# EasyEDA Pro project busmaster-v102.eprj, schematic bus-board
Board Name: bus-board; Create Date: 2025-11-10; Page Name: P1; Project Name: busmaster-v102; Schematic Name: bus-board; Update Date: 2025-11-12; Company: EasyEDA.com; Page Size: A4; Version: V1.0
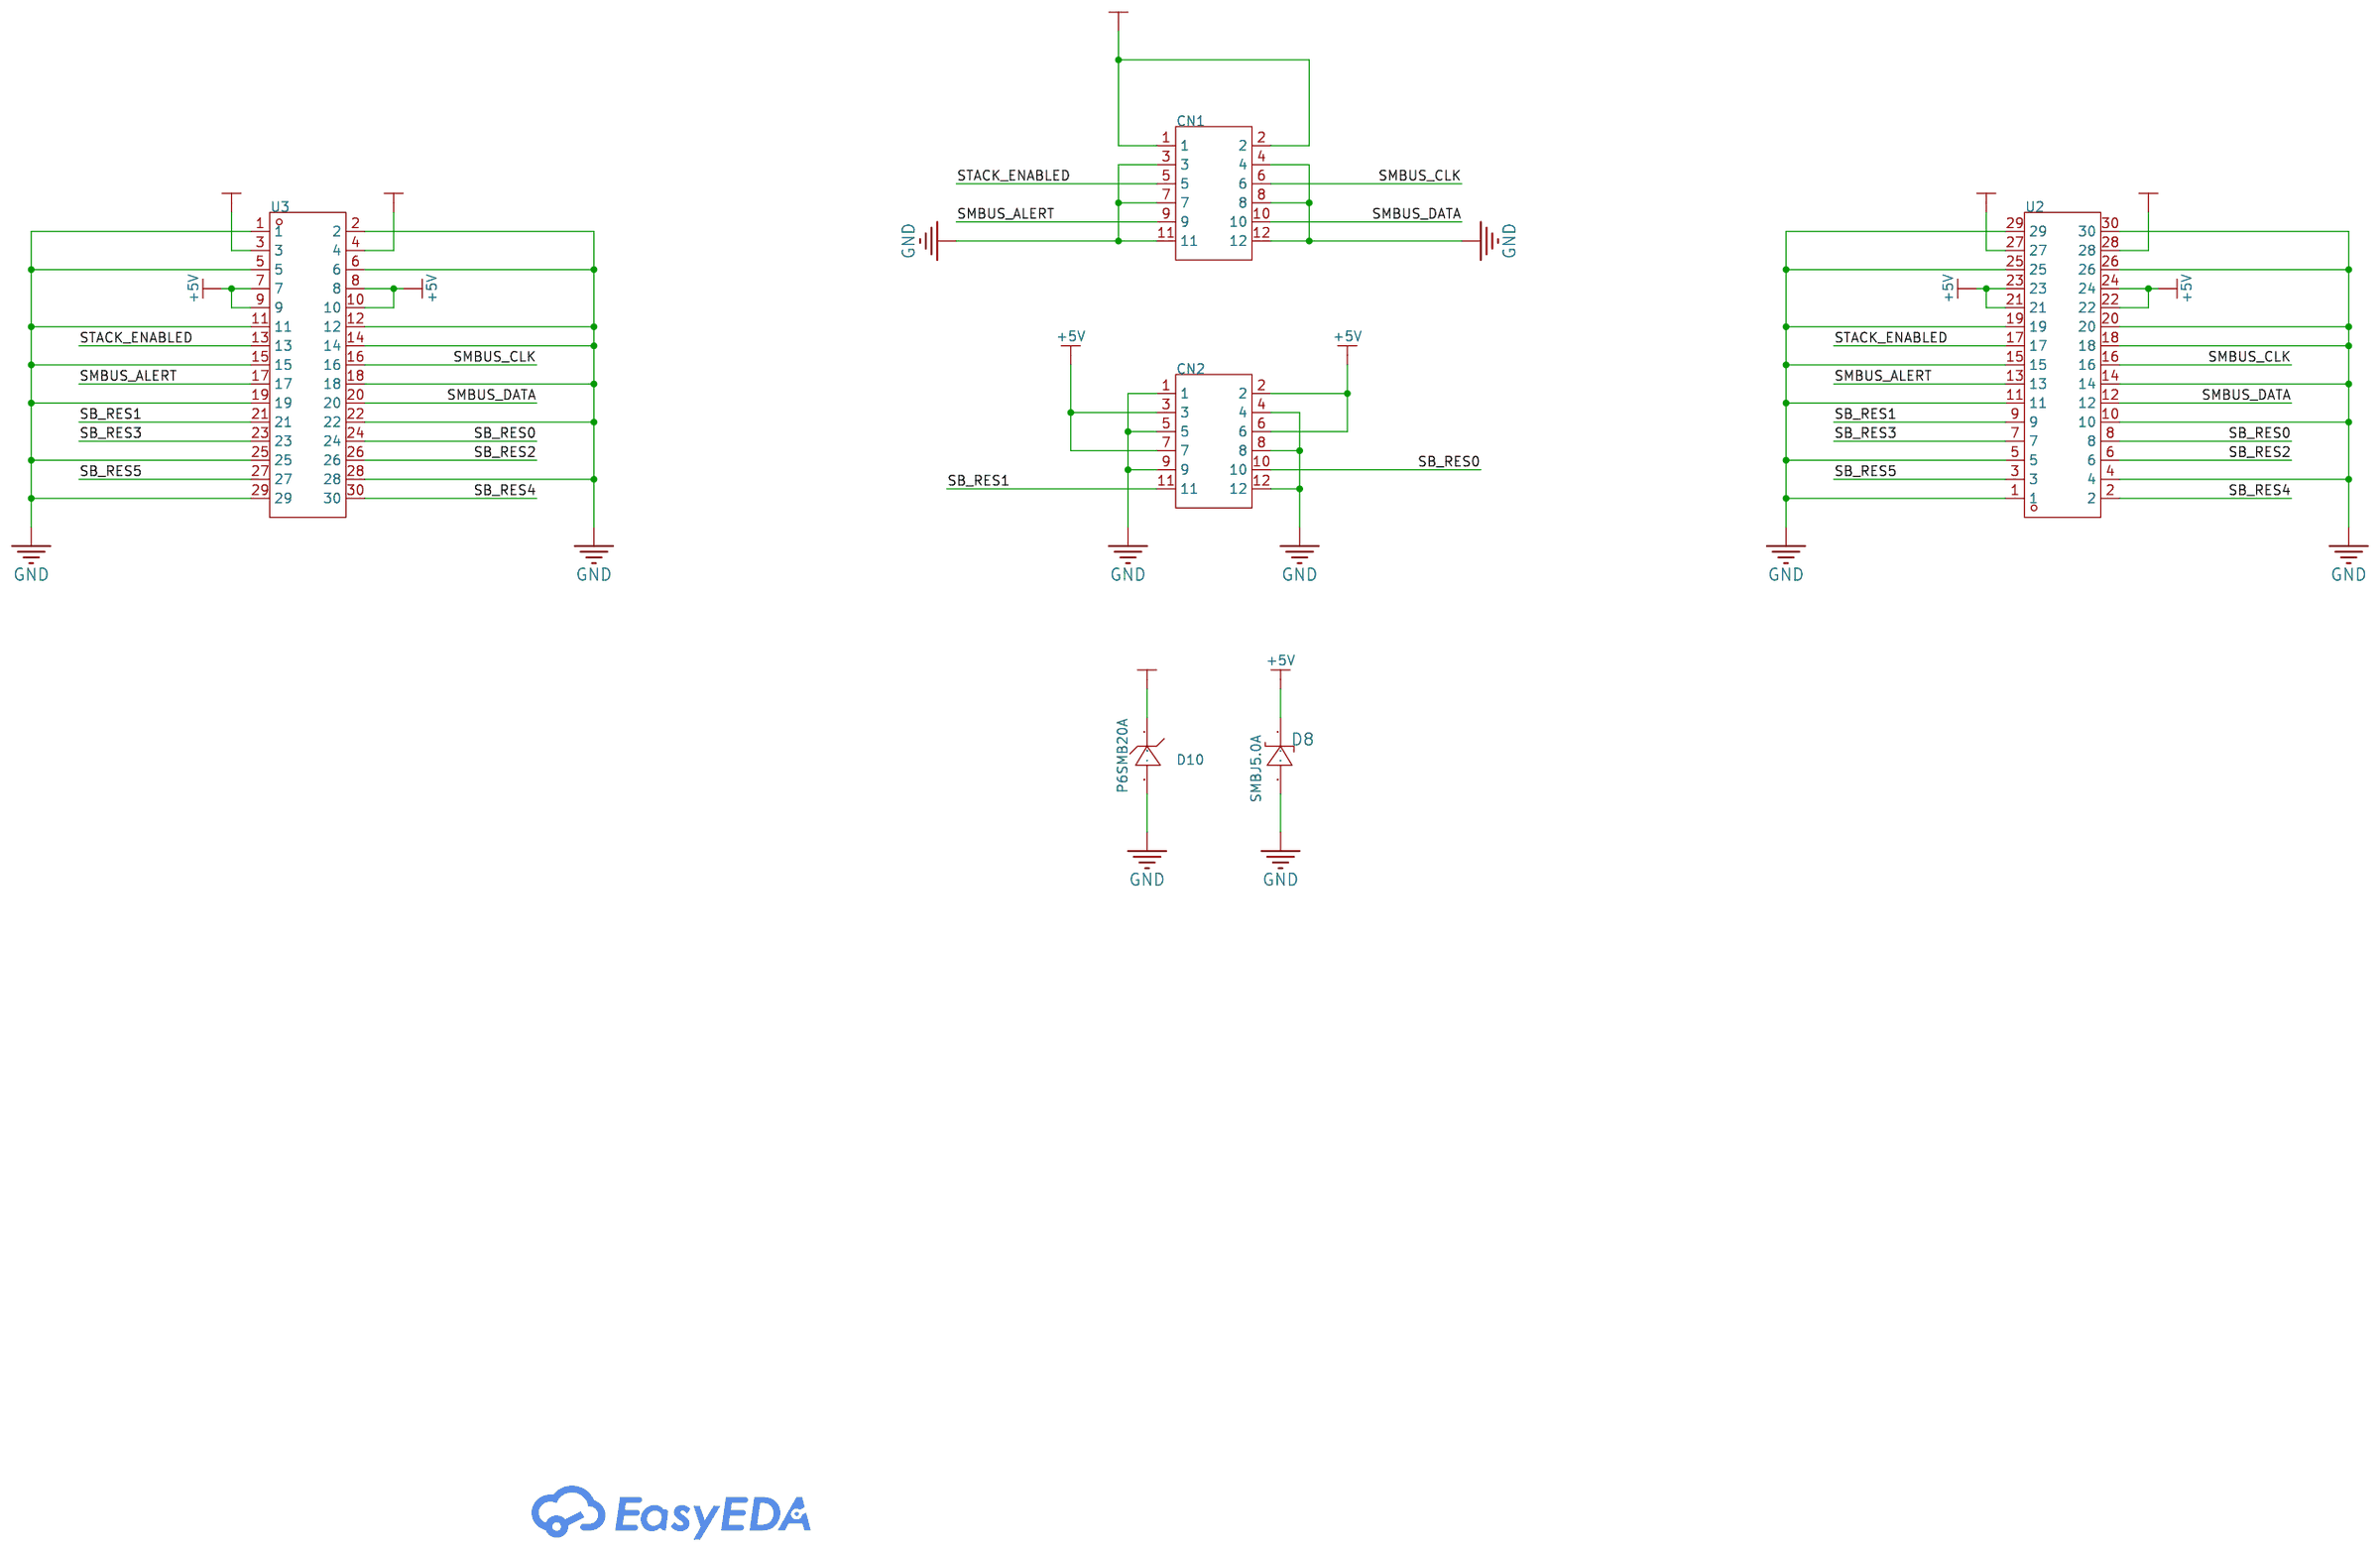
[diagram p0: schematic sheet]

## Parts
CN1  PH2.0-01-06PZS  [HDR-TH_12P-P2.00-V-M-R2-C6-S2.00]
CN2  PH2.0-01-06PZS  [HDR-TH_12P-P2.00-V-M-R2-C6-S2.00]
D8  SMBJ5.0A  [SMB_L4.6-W3.6-LS5.3-RD]
D10  P6SMB20A  [SMB_L4.5-W3.6-LS5.4-RD]
U2  PM254-2-15-W-8.5  [HDR-TH_30P-P2.54-H-F-R2-C15-W8.5]
U3  PM254-2-15-W-8.5  [HDR-TH_30P-P2.54-H-F-R2-C15-W8.5]

## Library data of the parts
CN1 CN2 = PH2.0-01-06PZS: Pin Structure:2x6P Pitch:2mm Row Spacing:2mm Circluar Pins/Square Pins:Pin Header Mounting Type:Through Hole Number of Rows:2 Number of Pins:12P Current Rating:1.5A Length of Mating Pin:3.9mm Insulation Height:2mm Length of End Connection Pin:2.8mm Contac; LCSC Part Name: 2x6P 间距:2mm 方针 直插; Supplier Part: C49286580; Manufacturer: XUNPU(讯普); Supplier Footprint: 插件,P=2mm; JLCPCB Part Class: Extended Part; Datasheet: https://item.szlcsc.com/datasheet/PH2.0-01-06PZS/51736339.html; Supplier: LCSC; Pin Structure: 2x6P; Pitch: 2mm; Row Spacing: 2mm; Circluar Pins/Square Pins: Pin Header; Mounting Type: Through Hole; Number of Rows: 2; Number of Pins: 12P; Current Rating: 1.5A; Length of Mating Pin: 3.9mm; Insulation Height: 2mm; Length of End Connection Pin: 2.8mm; Contact Material: Brass; Contact Plating: Gold; Operating Temperature: -40℃~+105℃; Color: Black
D8 = SMBJ5.0A_C10204: LCSC Part Name: 单向TVS 5V截止 峰值浪涌电流：65.3A@10/1000us; Supplier Part: C10204; Manufacturer: RUILON(瑞隆源); Supplier Footprint: DO-214AA(SMB); JLCPCB Part Class: Extended Part; Datasheet: https://item.szlcsc.com/datasheet/SMBJ5.0A/10744.html; Supplier: LCSC; Polarity: Unidirectional; Reverse Stand-Off Voltage (Vrwm): 5V; Clamping Voltage: 9.2V; Peak Pulse Current (Ipp): 65.3A@10/1000us; Peak Pulse Power Dissipation (Ppp): 600W@10/1000us; Voltage - Breakdown: 7.25V; Reverse Leakage Current (Ir): 800uA; Operating Temperature: -55℃~+150℃; level of protection: IEC 61000-4-4；IEC 61000-4-2; Type: TVS
D10 = P6SMB20A_C2916107: Supplier Part: C2916107; Manufacturer: DOWO(东沃); Supplier Footprint: SMB; JLCPCB Part Class: Extended Part; Datasheet: https://atta.szlcsc.com/upload/public/pdf/source/20211111/69C9124696FB34B8A3D6BD83C2FAA930.pdf; Supplier: LCSC; Reverse Stand-Off Voltage (Vrwm): 17.1V; Maximum Clamping Voltage: 27.7V; Peak Pulse Current (Ipp)@10/1000us: 21.66A; Breakdown Voltage: 19V; Reverse Leakage Current (Ir): 1uA; Type: TVS
U2 U3 = PM254-2-15-W-8.5: LCSC Part Name: 2x15P 间距:2.54mm 弯插; Supplier Part: C2897435; Manufacturer: HCTL(华灿天禄); Supplier Footprint: 弯插,P=2.54mm; JLCPCB Part Class: Extended Part; Datasheet: https://item.szlcsc.com/datasheet/PM254-2-15-W-8.5/3142440.html; Supplier: LCSC; Holes Structure: 2x15P; Pitch: 2.54mm; Row Spacing: 2.54mm; Circular Hole / Square Hole: Square Hole; Mounting Type: Right Angle; Number of Rows: 2; Number of Positions: 30P; Current Rating: 3A; Holes Direction: Side; Insulation Height: 8.5mm; Contact Material: Copper Alloy; Operating Temperature: -40℃~+105℃

## Nets
+5V: CN2.2 CN2.3 CN2.6 CN2.7 D8.1(K) U2.21 U2.22 U2.23 U2.24 U3.7 U3.8 U3.9 U3.10
+12V: CN1.1 CN1.2 D10.1(C) U2.27 U2.28 U3.3 U3.4
GND: CN1.3 CN1.4 CN1.7 CN1.8 CN1.11 CN1.12 CN2.1 CN2.4 CN2.5 CN2.8 CN2.9 CN2.12 D8.2(A) D10.2(A) U2.1 U2.4 U2.5 U2.10 U2.11 U2.14 U2.15 U2.18 U2.19 U2.20 U2.25 U2.26 U2.29 U2.30 U3.1 U3.2 U3.5 U3.6 U3.11 U3.12 U3.14 U3.15 U3.18 U3.19 U3.22 U3.25 U3.28 U3.29
SB_RES0: CN2.10 U2.8 U3.24
SB_RES1: CN2.11 U2.9 U3.21
SB_RES2: U2.6 U3.26
SB_RES3: U2.7 U3.23
SB_RES4: U2.2 U3.30
SB_RES5: U2.3 U3.27
SMBUS_ALERT: CN1.9 U2.13 U3.17
SMBUS_CLK: CN1.6 U2.16 U3.16
SMBUS_DATA: CN1.10 U2.12 U3.20
STACK_ENABLED: CN1.5 U2.17 U3.13
